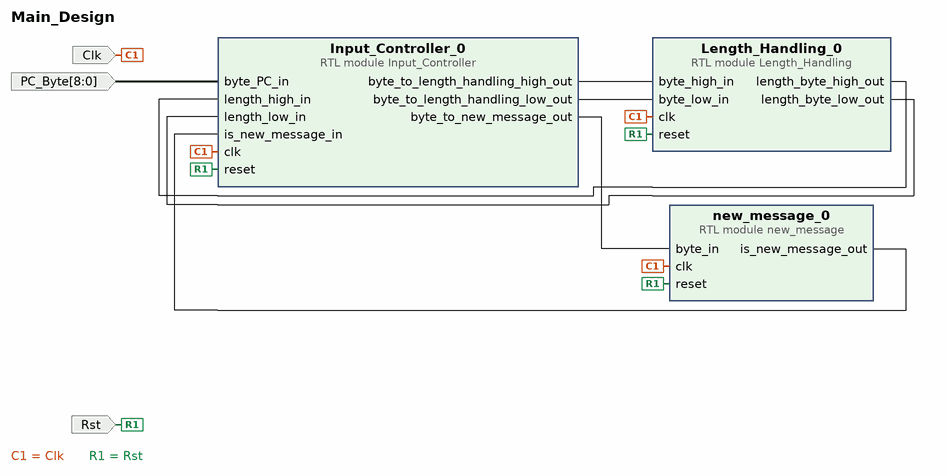
[diagram p0: block diagram of the top level]
# Vivado block design Main_Design, xc7a35tftg256-1, Vivado 2024.2
create_bd_design Main_Design

create_bd_port -dir I Clk
create_bd_port -dir I Rst
create_bd_port -dir I -from 8 -to 0 PC_Byte

create_bd_cell -type module -reference Input_Controller Input_Controller_0
create_bd_cell -type module -reference Length_Handling Length_Handling_0
create_bd_cell -type module -reference new_message new_message_0

# ---- connections ----

connect_bd_net [get_bd_ports Clk] [get_bd_pins Length_Handling_0/clk] [get_bd_pins new_message_0/clk] [get_bd_pins Input_Controller_0/clk]
connect_bd_net [get_bd_pins Input_Controller_0/byte_to_length_handling_high_out] [get_bd_pins Length_Handling_0/byte_high_in]
connect_bd_net [get_bd_pins Input_Controller_0/byte_to_length_handling_low_out] [get_bd_pins Length_Handling_0/byte_low_in]
connect_bd_net [get_bd_pins Input_Controller_0/byte_to_new_message_out] [get_bd_pins new_message_0/byte_in]
connect_bd_net [get_bd_pins Length_Handling_0/length_byte_high_out] [get_bd_pins Input_Controller_0/length_high_in]
connect_bd_net [get_bd_pins Length_Handling_0/length_byte_low_out] [get_bd_pins Input_Controller_0/length_low_in]
connect_bd_net [get_bd_ports PC_Byte] [get_bd_pins Input_Controller_0/byte_PC_in]
connect_bd_net [get_bd_ports Rst] [get_bd_pins Length_Handling_0/reset] [get_bd_pins new_message_0/reset] [get_bd_pins Input_Controller_0/reset]
connect_bd_net [get_bd_pins new_message_0/is_new_message_out] [get_bd_pins Input_Controller_0/is_new_message_in]

validate_bd_design
save_bd_design
